# Altium project RFInterface.PrjPcb
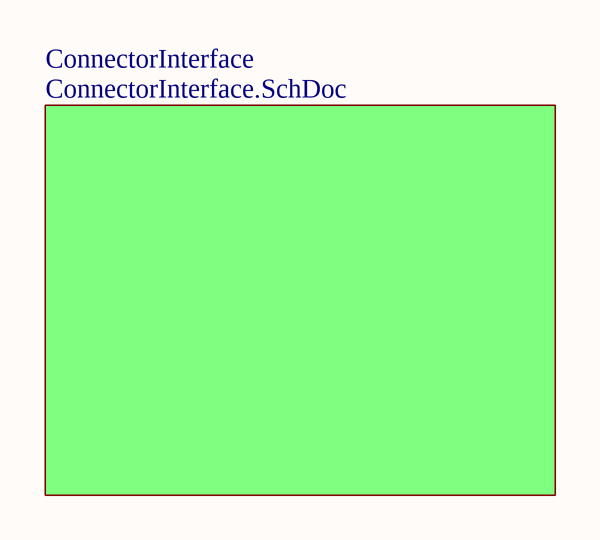
[diagram p0: TopLevel.SchDoc]
6 sheets, 103 parts. Net scope: flat (ports and power ports of the same name join across sheets).
Board file: RFI.PcbDoc
Sheets:
  TopLevel.SchDoc
    ConnectorInterface = ConnectorInterface.SchDoc
      RF_PDU = RF_PDU.SchDoc
      RF_Bypass = RF_Bypass.SchDoc
      RF_Gen = RF_Gen.SchDoc
      DAC = DAC.SchDoc

## Sheet TopLevel.SchDoc
size 215 x 279 mm; SheetNumber: 1; SheetTotal: 6

### Sub-sheets
ConnectorInterface = ConnectorInterface.SchDoc: no entries

### Notes on the sheet
- Contents
- Revision Notes

## Sheet ConnectorInterface.SchDoc
size 215 x 279 mm; SheetNumber: 2; SheetTotal: 6
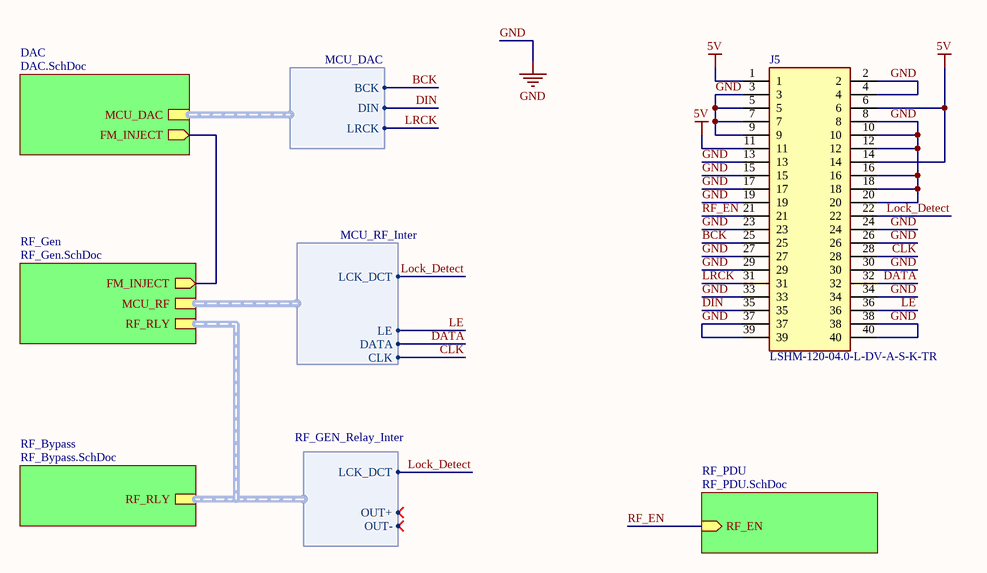
[diagram p1: ConnectorInterface.SchDoc]

### Parts
J5  LSHM-120-04.0-L-DV-A-S-K-TR  [LSHM-120-XX.X-YYY-DV-A-S-K-TR]

### Sub-sheets
DAC = DAC.SchDoc: FM_INJECT (out), MCU_DAC (harness MCU_DAC)
RF_Bypass = RF_Bypass.SchDoc: RF_RLY (harness RF_GEN_Relay_Inter)
RF_Gen = RF_Gen.SchDoc: MCU_RF (harness MCU_RF_Inter), FM_INJECT (out), RF_RLY (harness RF_GEN_Relay_Inter)
RF_PDU = RF_PDU.SchDoc: RF_EN (in)

### Harnesses
MCU_RF_Inter: LCK_DCT, LE, DATA, CLK
MCU_DAC: BCK, DIN, LRCK
RF_GEN_Relay_Inter: LCK_DCT, OUT+, OUT-

### Nets
5V: J5.1 J5.6 J5.11 J5.14
GND: J5.2 J5.3 J5.4 J5.5 J5.7 J5.8 J5.9 J5.10 J5.12 J5.13 J5.15 J5.16 J5.17 J5.18 J5.19 J5.20 J5.23 J5.24 J5.26 J5.27 J5.29 J5.30 J5.33 J5.34 J5.37 J5.38 J5.39 J5.40
BCK: J5.25 ; sheet DAC/MCU_DAC.BCK
CLK: J5.28 ; sheet RF_Gen/MCU_RF.CLK
DATA: J5.32 ; sheet RF_Gen/MCU_RF.DATA
DIN: J5.35 ; sheet DAC/MCU_DAC.DIN
LE: J5.36 ; sheet RF_Gen/MCU_RF.LE
Lock_Detect: J5.22 ; sheet RF_Gen/MCU_RF.LCK_DCT, sheet RF_Bypass/RF_RLY.LCK_DCT
LRCK: J5.31 ; sheet DAC/MCU_DAC.LRCK
RF_EN: J5.21 ; sheet RF_PDU/RF_EN
(unnamed): sheet RF_Gen/FM_INJECT, sheet DAC/FM_INJECT

### Buses and harness runs
harness sheet RF_Bypass/RF_RLY = sheet RF_Gen/RF_RLY

### Notes on the sheet
- Contents
- Revision Notes

### Library data of the parts
J5 = LSHM-120-04.0-L-DV-A-S-K-TR: Connector; Manufacturer_Name: SAMTEC; Datasheet Link: http://suddendocs.samtec.com/prints/lshm-1xx-xx.x-xxx-dv-a-x-x-xx-mkt.pdf; Manufacturer_Part_Number: LSHM-120-04.0-L-DV-A-S-K-TR; Mouser Part Number: 200-LSHM12004LDVASK; Mouser Price/Stock: https://www.mouser.co.uk/ProductDetail/Samtec/LSHM-120-040-L-DV-A-S-K-TR?qs=PB6%2FjmICvI1v5WBlLc04lg%3D%3D; Arrow Part Number: LSHM-120-04.0-L-DV-A-S-K-TR; Arrow Price/Stock: https://www.arrow.com/en/products/lshm-120-04.0-l-dv-a-sktr/samtec?region=nac

## Sheet RF_PDU.SchDoc
size 279 x 215 mm; SheetNumber: 6; SheetTotal: 6
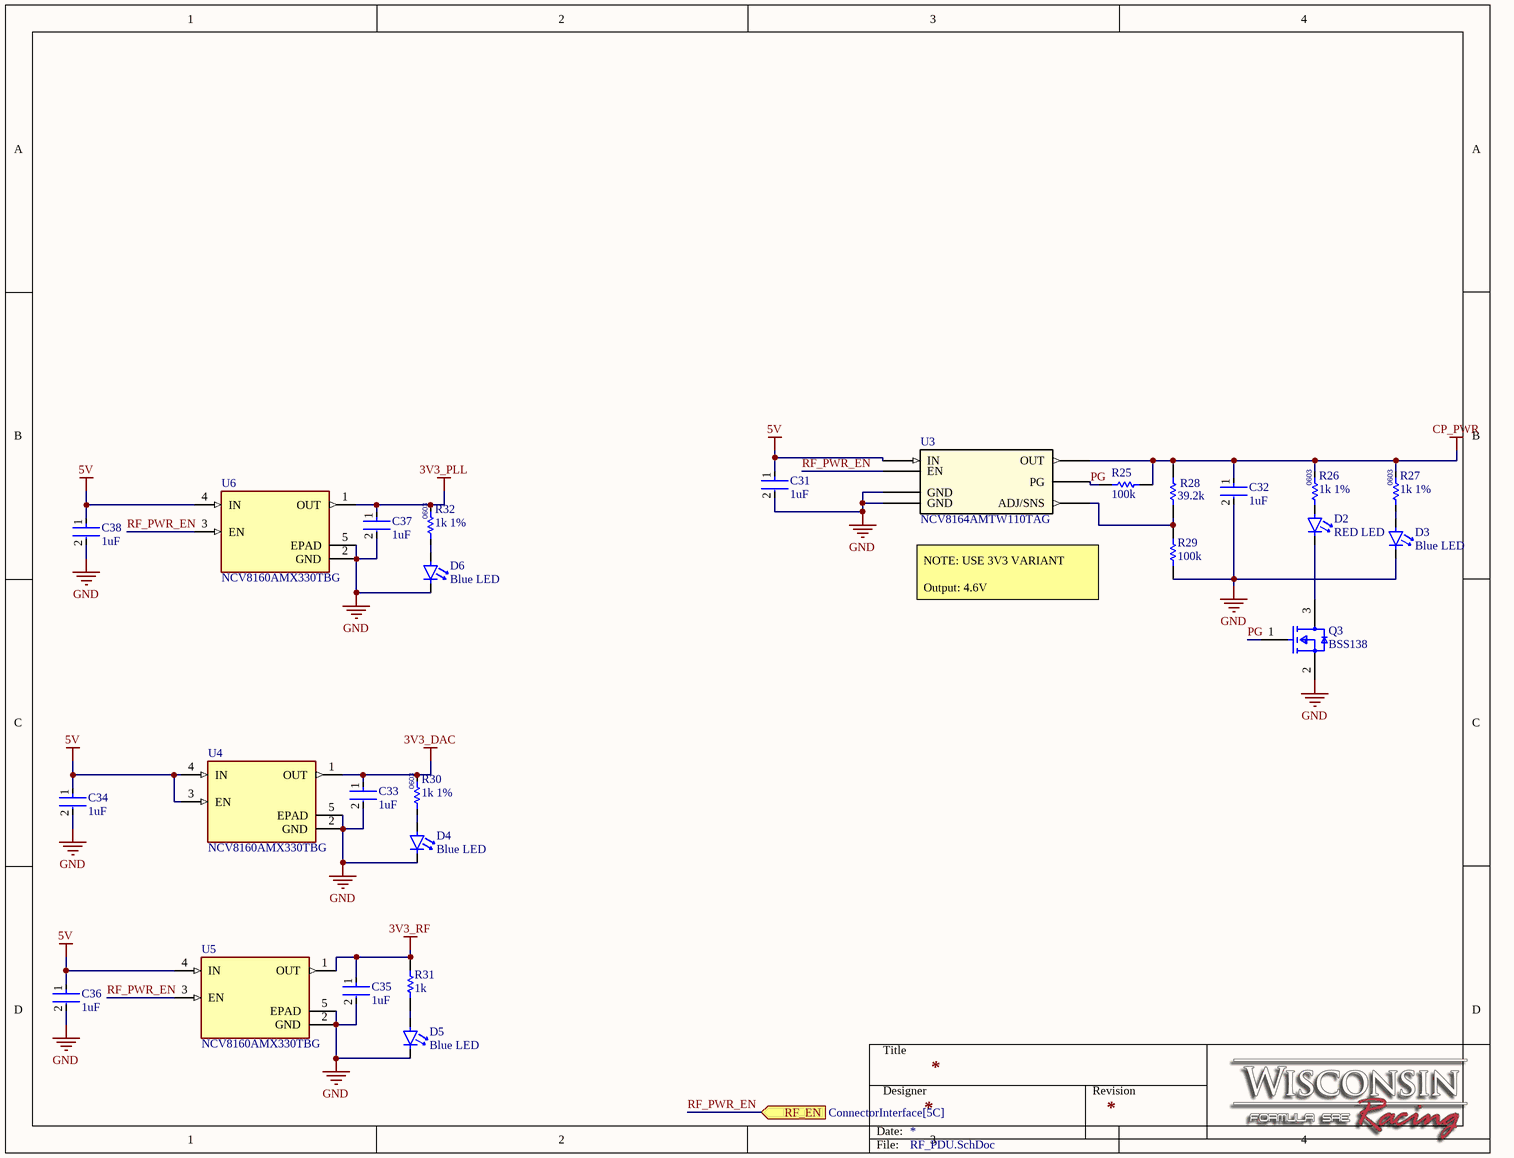
[diagram p2: RF_PDU.SchDoc]

### Parts
C31  1uF  [FP-GRM155-0_1-IPC_C]
C32  1uF  [FP-GRM155-0_1-IPC_C]
C33  1uF  [FP-GRM155-0_1-IPC_C]
C34  1uF  [FP-GRM155-0_1-IPC_C]
C35  1uF  [FP-GRM155-0_1-IPC_C]
C36  1uF  [FP-GRM155-0_1-IPC_C]
C37  1uF  [FP-GRM155-0_1-IPC_C]
C38  1uF  [FP-GRM155-0_1-IPC_C]
D2  RED LED  [DIOC1608X05N]
D3  Blue LED  [0603-LED-1]
D4  Blue LED  [0603-LED-1]
D5  Blue LED  [0603-LED-1]
D6  Blue LED  [0603-LED-1]
Q3  BSS138  [FP-318-08-IPC_B]
R25  100k  [RESC1005X40X25NL05T10]
R26  1k 1%  [Res0603-type-1]
R27  1k 1%  [Res0603-type-1]
R28  39.2k  [RESC1005X40X25ML05T10]
R29  100k  [RESC1005X40X25NL05T10]
R30  1k 1%  [Res0603-type-1]
R31  1k  [RESC1005X40X25LL05T10]
R32  1k 1%  [Res0603-type-1]
U3  NCV8164AMTW110TAG  [WDFNW6_511DW_OSI]
U4  NCV8160AMX330TBG  [VREG_NCV8160AMX330TBG]
U5  NCV8160AMX330TBG  [VREG_NCV8160AMX330TBG]
U6  NCV8160AMX330TBG  [VREG_NCV8160AMX330TBG]

### Ports
RF_EN (in, see ConnectorInterface[5C])

### Nets
3V3_DAC: C33.1 R30.2 U4.1(OUT)
3V3_PLL: C37.1 R32.2 U6.1(OUT)
3V3_RF: C35.1 R31.2 U5.1(OUT)
5V: C31.1 C34.1 C36.1 C38.1 U3.6(IN) U4.3(EN) U4.4(IN) U5.4(IN) U6.4(IN)
CP_PWR: C32.1 R25.1 R26.2 R27.2 R28.2 U3.1(OUT)
GND: C31.2 C32.2 C33.2 C34.2 C35.2 C36.2 C37.2 C38.2 D3.1(C) D4.1(C) D5.1(C) D6.1(C) Q3.2(S) R29.1 U3.5(GND) U3.7(GND) U4.2(GND) U4.5(EPAD) U5.2(GND) U5.5(EPAD) U6.2(GND) U6.5(EPAD)
PG: Q3.1(G) R25.2 U3.3(PG)
RF_PWR_EN: U3.4(EN) U5.3(EN) U6.3(EN) ; port RF_EN
NetD2_1: D2.1(C) Q3.3(D)
NetD3_2: D3.2(A) R27.1
NetD4_2: D4.2(A) R30.1
NetD5_2: D5.2(A) R31.1
NetD6_2: D6.2(A) R32.1
NetR28_1: R28.1 R29.2 U3.2(ADJ/SNS)

Not connected (* = marked no-connect by the designer): D2 2(A); R26 1

### Notes on the sheet
- NOTE: USE 3V3 VARIANT
  Output: 4.6V
- Title
- Designer
- Revision
- Date:
- File:
- (in symbol CMP-005-000017-1) 0603

### Library data of the parts
C31-C38 = CMP-06035-028020-1: Chip Multilayer Ceramic Capacitors for General Purpose, 0402, 1.0uF, X7R, 15%, 10%, 10V / GRM155Z71A105KE01D
D2 = CMP-221-0013-1: 0603 Red SMD Led; Datasheet: https://www.aopled.com/AOP_PDFs/L196L-LIC.pdf
D3-D6 = CMP-LED-0000-10: Single Color LED, Blue, Water Clear, 1.1mm; Lens Color: Colorless; Wavelength: 468nm; Luminous Intensity: 180mcd; Number of Elements: 1; Power Dissipation: 76mW; Max Power Dissipation: 75mW; Forward Current: 20mA; Forward Voltage: 3.8V; Lens Style: Diffused,Colorless,Clear,Rectangular; Dominant Wavelength: 475nm; Viewing Angle: 130°; Reverse Voltage: 5V; Length: 0.8mm; Max Operating Temperature: 80°C; Height: 0.55mm; Mount: Surface Mount; Number of Pins: 2; Lens Transparency: Clear; Color: Blue; Radiation Hardening: No; Illumination Color: Blue; Depth: 1.6mm; Packaging: Tape and Reel; Case Code (Imperial): 0603; Number of LEDs: 1; Lead Free: Lead Free; Case Code (Metric): 1608; Width: 0.8mm; Min Operating Temperature: -20°C; Case/Package: 0603; Package Quantity: 1; Test Current: 20mA
Q3 = CMP-07173-000101-1: MOSFET N-CH 50V 220MA SOT-23; Turn-Off Delay Time: 20ns; Element Configuration: Single; Rds On Max: 3.5R; Gate to Source Voltage (Vgs): 20V; Threshold Voltage: 1.3V; Number of Elements: 1; Power Dissipation: 360mW; Rise Time: 9ns; Turn-On Delay Time: 2.5ns; Input Capacitance: 27pF; On-State Resistance: 6R; Lead Free: Lead Free; Length: 2.92mm; Width: 1.3mm; Drain to Source Breakdown Voltage: 50V; Min Operating Temperature: -55°C; REACH SVHC: No SVHC; Packaging: Tape and Reel; Radiation Hardening: No; Height: 0.93mm; Drain to Source Voltage (Vdss): 50V; Current Rating: 220mA; Voltage Rating (DC): 50V; Weight: 0.03g; Continuous Drain Current (ID): 220mA; Number of Pins: 3; Nominal Vgs: 1.3V; Max Power Dissipation: 360mW; Fall Time: 9ns; Drain to Source Resistance: 3.5R; Contact Plating: Tin; Case/Package: SOT-23; Package Quantity: 1; Dual Supply Voltage: 50V; Mount: Surface Mount; Termination: SMD/SMT; Max Operating Temperature: 150°C
R25 R29 = CMP-2002-07343-1: Part Number: RC0402FR-07100KL; Manufacturer: Yageo / Phycomp
R26 R27 R30 R32 = CMP-005-000017-1: Fixed Resistor, Metal Glaze/thick Film, 0.1W, 1000ohm, 75V, 1% +/-Tol, 100ppm/Cel, Surface Mount, 0603; Min Operating Temperature: -55°C; Mount: Surface Mount; Packaging: Tape and Reel; Max Operating Temperature: 155°C
R28 = CMP-2002-07644-1: Part Number: RC0402FR-0739K2L; Manufacturer: Yageo
R31 = CMP-2002-07941-1: Part Number: RC0402JR-071KL; Manufacturer: Yageo / Phycomp
U3 = CMP-196-000000-3: LDO; Manufacturer_Name: onsemi; Source: NCV8164AMTW110TAG.SchLib; RefDes: RefDes; Design Item ID: NCV8164AMTW110TAG; Copyright: Copyright (C) 2025 Ultra Librarian. All rights reserved.; Manufacturer_Part_Number: NCV8164AMTW110TAG; Type: Power Management
U4-U6 = CMP-006-000097-1: Linear Voltage Regulator IC Positive Fixed 1 Output 250mA 4-XDFN (1x1); MF: ON Semiconductor; Design Item ID: NCV8160AMX330TBG; SnapEDA_Link: https://www.snapeda.com/parts/NCV8160AMX330TBG/Onsemi/view-part/?ref=snap; Pin Count: 5; Check_prices: https://www.snapeda.com/parts/NCV8160AMX330TBG/Onsemi/view-part/?ref=eda; Value: *; MP: NCV8160AMX330TBG; Source: NCV8160AMX330TBG.SchLib; Component Type: Standard; Package: XDFN-4 ON Semiconductor

## Sheet RF_Bypass.SchDoc
size 279 x 215 mm; SheetNumber: 5; SheetTotal: 6
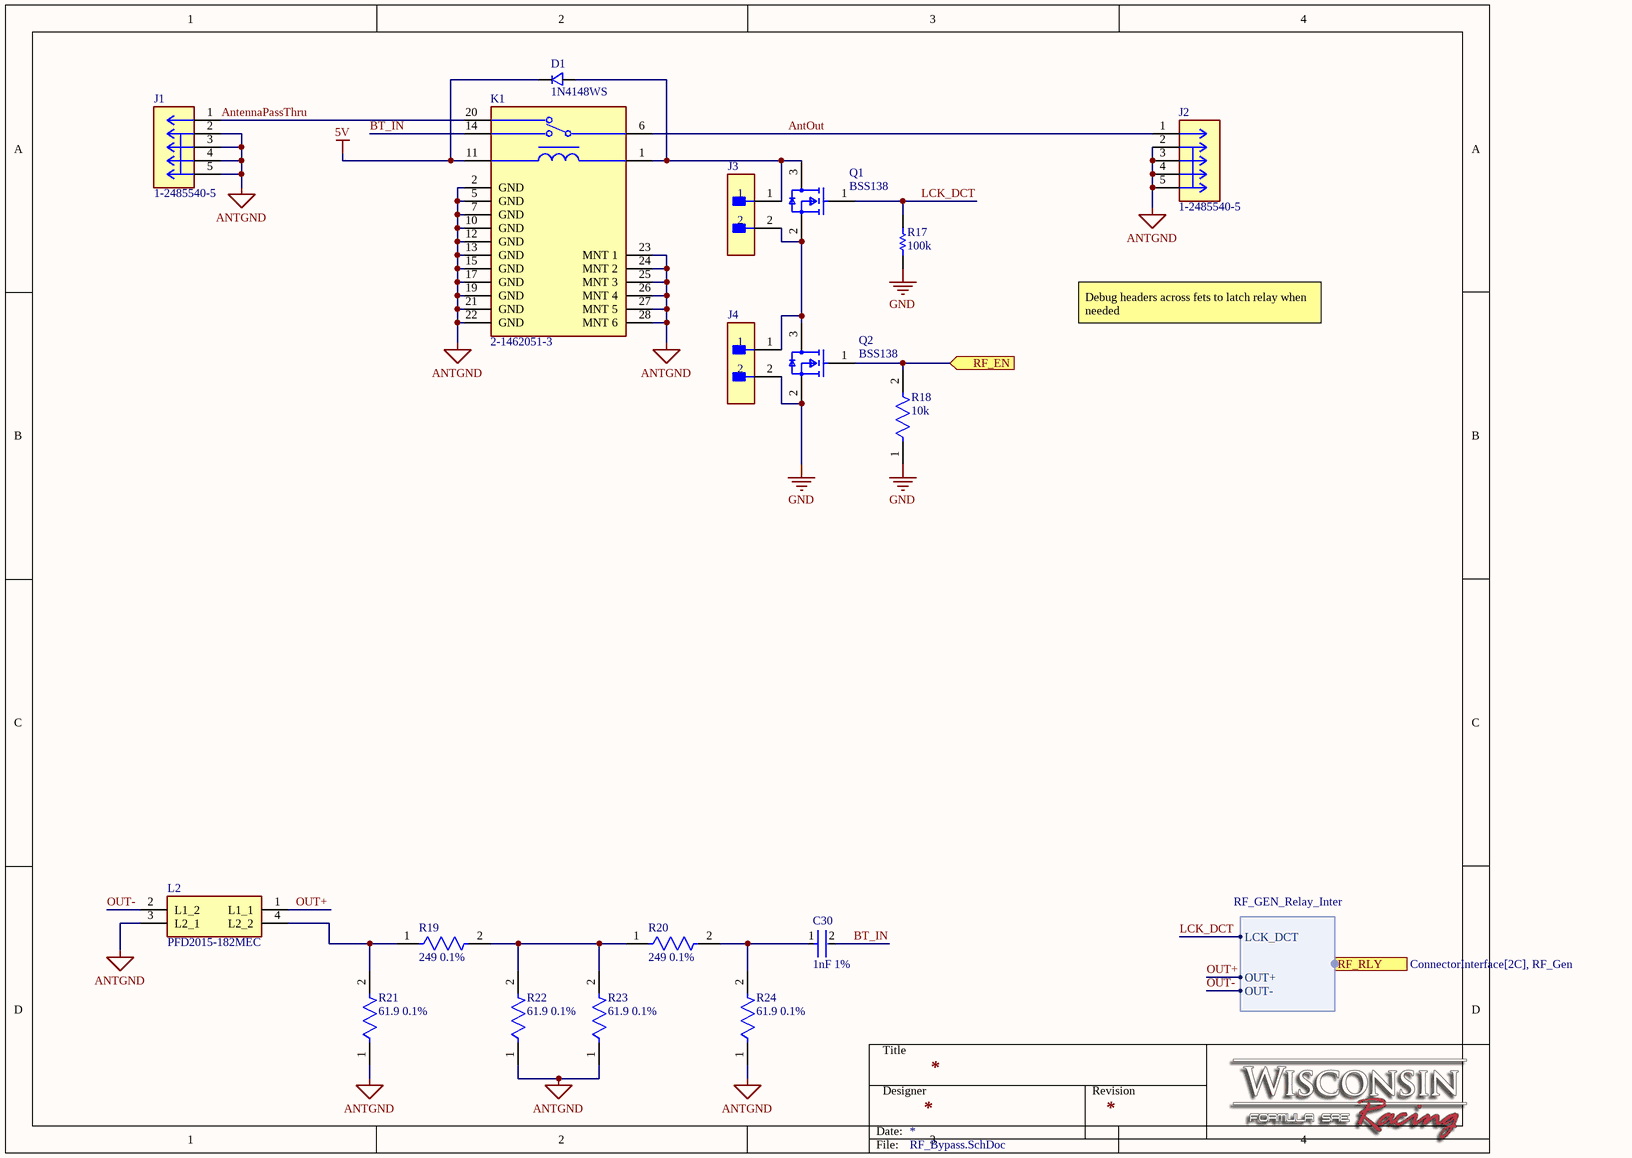
[diagram p3: RF_Bypass.SchDoc]

### Parts
C30  1nF 1%  [FP-GRT155-0_05-IPC_A]
D1  1N4148WS  [SODFL250X90-2N]
J1  1-2485540-5  [1-2485540-5-Footprint-1]
J2  1-2485540-5  [1-2485540-5-Footprint-1]
J3  TSM-102-01-T-SV-TR  [FP-TSM-102-01-T-SV-TR-MFG]  (value not drawn)
J4  TSM-102-01-T-SV-TR  [FP-TSM-102-01-T-SV-TR-MFG]  (value not drawn)
K1  2-1462051-3  [FP-2-1462051-3-MFG]
L2  PFD2015-182MEC  [PFD2015102MEB]
Q1  BSS138  [FP-318-08-IPC_B]
Q2  BSS138  [FP-318-08-IPC_B]
R17  100k  [RESC1005X40X25NL05T10]
R18  10k  [FP-RC0402-0_4-IPC_C]
R19  249 0.1%  [FP-RT0402-MFG]
R20  249 0.1%  [FP-RT0402-MFG]
R21  61.9 0.1%  [FP-RP73P-1E-MFG]
R22  61.9 0.1%  [FP-RP73P-1E-MFG]
R23  61.9 0.1%  [FP-RP73P-1E-MFG]
R24  61.9 0.1%  [FP-RP73P-1E-MFG]

### Ports
RF_EN (in), RF_RLY (harness RF_GEN_Relay_Inter, see ConnectorInterface[2C], RF_Gen)

### Harnesses
RF_GEN_Relay_Inter: LCK_DCT, OUT+, OUT-

### Nets
5V: D1.1 K1.11(-)
ANTGND: J1.2 J1.3 J1.4 J1.5 J2.2 J2.3 J2.4 J2.5 K1.2(GND) K1.5(GND) K1.7(GND) K1.10(GND) K1.12(GND) K1.13(GND) K1.15(GND) K1.17(GND) K1.19(GND) K1.21(GND) K1.22(GND) K1.23(MNT_1) K1.24(MNT_2) K1.25(MNT_3) K1.26(MNT_4) K1.27(MNT_5) K1.28(MNT_6) L2.3(L2_1) R21.1 R22.1 R23.1 R24.1
GND: J4.2 Q2.2(S) R17.1 R18.1
AntennaPassThru: J1.1 K1.20
AntOut: J2.1 K1.6
BT_IN: C30.2 K1.14
LCK_DCT: Q1.1(G) R17.2 ; port RF_RLY.LCK_DCT
OUT+: L2.1(L1_1) ; port RF_RLY.OUT+
OUT-: L2.2(L1_2) ; port RF_RLY.OUT-
RF_PWR_EN: Q2.1(G) R18.2 ; port RF_EN
NetC30_1: C30.1 R20.2 R24.2
NetD1_2: D1.2 J3.1 K1.1(+) Q1.3(D)
NetJ3_2: J3.2 J4.1 Q1.2(S) Q2.3(D)
NetL2_4: L2.4(L2_2) R19.1 R21.2
NetR19_2: R19.2 R20.1 R22.2 R23.2

### Notes on the sheet
- Debug headers across fets to latch relay when needed
- Title
- Designer
- Revision
- Date:
- File:

### Library data of the parts
C30 = CMP-06035-012909-1: Multi-Layer Ceramic Capacitor 1nF 50V C0G ±1% 0402 Paper T/R / GRT1555C1H102FA02D
D1 = CMP-REC-0001-6: Diode
J1 J2 = CMP-00172-1: FAKRA Connector, Plug, 50 ohm, Locking, 6 GHz, Cable-to-Board, 1 Position, Printed Circuit Board, -40 – 105 °C [-40 – 221 °F], Solder, FAKRA
J3 J4 = CMP-02766-000113-1: CONN HEADER SMD 2POS 2.54MM; Gender: Male; Max Voltage Rating (AC): 475V; Number of Contacts: 2; Max Current Rating: 7A; Contact Material: Bronze; Min Operating Temperature: -55°C; REACH SVHC: No SVHC; Housing Material: Polymer; Lead Free: Lead Free; Orientation: Straight; Radiation Hardening: No; Number of Rows: 1; Length: 5.08mm; Housing Color: Black; Max Operating Temperature: 105°C; Contact Plating: Tin; Depth: 2.54mm; Packaging: Tape and Reel; Pitch: 2.54mm; Termination: Solder
K1 = CMP-03396-000136-1: RELAY RF SPDT 2A 5V; Max Voltage Rating (AC): 250V; Contact Voltage Rating (DC): 220V; Operate Time: 3ms; Actuating System: DC; Release Time: 5ms; Coil Resistance: 178R; Coil Current: 28.1mA; Insertion Loss: -0.3dB; Coil Power: 140mW; Coil Type: Non-Latching; Contact Current Rating: 2A; Radiation Hardening: No; Voltage Rating (AC): 250V; ELV: Compliant; Max Voltage Rating (DC): 220V; Min Operating Temperature: -55°C; Coil Voltage (DC): 5V; Number of Pins: 22; Max Current Rating: 2A; Height: 10.5mm; Package Quantity: 250; Termination: PCB; Length: 14.9inch; RoHS Compliant: No; Packaging: Box; Width: 0.295inch; Depth: 9.4mm; Relay Type: Relay; Mount: Surface Mount; Throw Configuration: SPDT; Contact Plating: Gold; Contact Material: Nickel; Weight: 3oz; Series: HF3S, AXICOM; Max Operating Temperature: 85°C
L2 = PFD2015-102MEB: Inductor; Manufacturer_Name: COILCRAFT; Datasheet Link: https://www.coilcraft.com/pdfs/pfd2015_flyback.pdf; Height: 1.5mm; Manufacturer_Part_Number: PFD2015-102MEB; Mouser Part Number: 994-PFD2015-102MEB; Mouser Price/Stock: https://www.mouser.com/Search/Refine.aspx?Keyword=994-PFD2015-102MEB
Q1 Q2 = CMP-07173-000101-1: as Q3 on sheet RF_PDU; Lead Free: Lead Free; Length: 2.92mm; Width: 1.3mm; Drain to Source Breakdown Voltage: 50V; Min Operating Temperature: -55°C; REACH SVHC: No SVHC; Packaging: Tape and Reel; Radiation Hardening: No; Height: 0.93mm; Drain to Source Voltage (Vdss): 50V; Current Rating: 220mA; Voltage Rating (DC): 50V; Weight: 0.03g; Continuous Drain Current (ID): 220mA; Number of Pins: 3; Nominal Vgs: 1.3V; Max Power Dissipation: 360mW; Fall Time: 9ns; Drain to Source Resistance: 3.5R; Contact Plating: Tin; Case/Package: SOT-23; Package Quantity: 1; Dual Supply Voltage: 50V; Mount: Surface Mount; Termination: SMD/SMT; Max Operating Temperature: 150°C
R17 = CMP-2002-07343-1: as R25 on sheet RF_PDU
R18 = CMP-2002-07915-3: RES 10K OHM 5% 1/16W 0402; Max Power Dissipation: 63mW; Temperature Coefficient: 100ppm/°C; Power Rating: 62.5mW; Resistance: 10kR; Voltage Rating: 50V; Size Code: 0402; Resistance Tolerance: 5%; Packaging: Tape and Reel; Case Code (Metric): 1005; Lead Free: Lead Free; Resistor Type: Thick Film; Min Operating Temperature: -55°C; Military Standard: Not; Depth: 0.5mm; Series: RC; Case/Package: 0402; Construction: Rectangular; Number of Terminations: 2; Package Quantity: 1; Termination: SMD/SMT; Length: 0.039inch; Case Code (Imperial): 0402; Height: 0.016inch; Features: Moisture Resistant; RoHS Compliant: Yes; Max Operating Temperature: 155°C; Tolerance: 5%; Width: 0.02inch
R19 R20 = CMP-2002-02712-2: RES SMD 249 OHM 0.1% 1/16W 0402; Manufacturer: Yageo; Manufacturer Part Number: RT0402BRD07249RL; Temperature Coefficient: 25 ppm/°C; Power Rating: 0.063W; Value: 249Ω; Voltage Rating: 50V; Tolerance: 0.001; Footprint Url: http://www.yageo.com/exep/pages/download/literatures/PYu-R_Mount_10.pdf; Device Class L3: Chip SMD Resistors; Category: Res; Resistance: 249Ω; Device Class L2: Resistors; Height: 0.35mm; Device Class L1: Passive Components; Package: RT0402; Ipc Land Pattern Name: RESC10050X30; Temperature Range Low: -55°C; Lead Free: Yes; ComponentLink2Description: Datasheet; Octopart: https://octopart.com/rt0402brd07249rl-yageo-1467928; Digikey Description: RES SMD 249 OHM 0.1% 1/16W 0402; Automotive: No; Composition: Thin Film; Temperature: -55°C to +155°C; RoHS: TRUE; Temperature Range High: +155°C; Series: RT; Mouser Description: Thin Film Resistors - SMD 1/16W 249 ohm .1% 25ppm; ComponentLink2URL: http://www.yageo.com/documents/recent/PYu-RT_1-to-0.01_RoHS_L_9.pdf
R21-R24 = CMP-03211-009150-1: RP73P 0402 61.9Ω 0.1W 25ppm/°C 0.10% 50V; Manufacturer: TE Connectivity; Manufacturer Part Number: RP73PF1E61R9BTD; Temperature Coefficient: 25ppm/°C; Temperature: -55°C to +155°C; Voltage Rating: 50V; Composition: Thin Film; Value: 61.9Ω; Ipc Land Pattern Name: RESC10050X30; Device Class L3: Chip SMD Resistors; Resistance: 61.9Ω; Octopart: https://octopart.com/rp73pf1e61r9btd-te+connectivity-89230235; ComponentLink2URL: https://www.te.com/commerce/DocumentDelivery/DDEController?Action=srchrtrv&DocNm=1773272&DocType=DS&DocLang=English; RoHS: TRUE; Device Class L2: Resistors; Series: RP73P; Temperature Range Low: -55°C; Category: Res; ComponentLink2Description: Datasheet; Temperature Range High: +155°C; Height: 0.35mm; Lead Free: Yes; Automotive: No; Power Rating: 0.1W; Package: RP73P-1E; Device Class L1: Passive Components; Tolerance: 0.10%

## Sheet RF_Gen.SchDoc: RF Generation & Regulation
size 279 x 215 mm; Engineer: Shaashwat Sahoo; Revision: V1.0; SheetNumber: 3; SheetTotal: 6; SPICEModelCacheMXYIGOMC: <root> / <DocumentId>MXYIGOMC</DocumentId> / <CacheFrame Number="0"> / <Model Name="cap" Kind="MDL"> / <Text>*Default semiconductor capacitor / .MODEL CAP C()</Text> / </Model> / </CacheFrame> / </root>
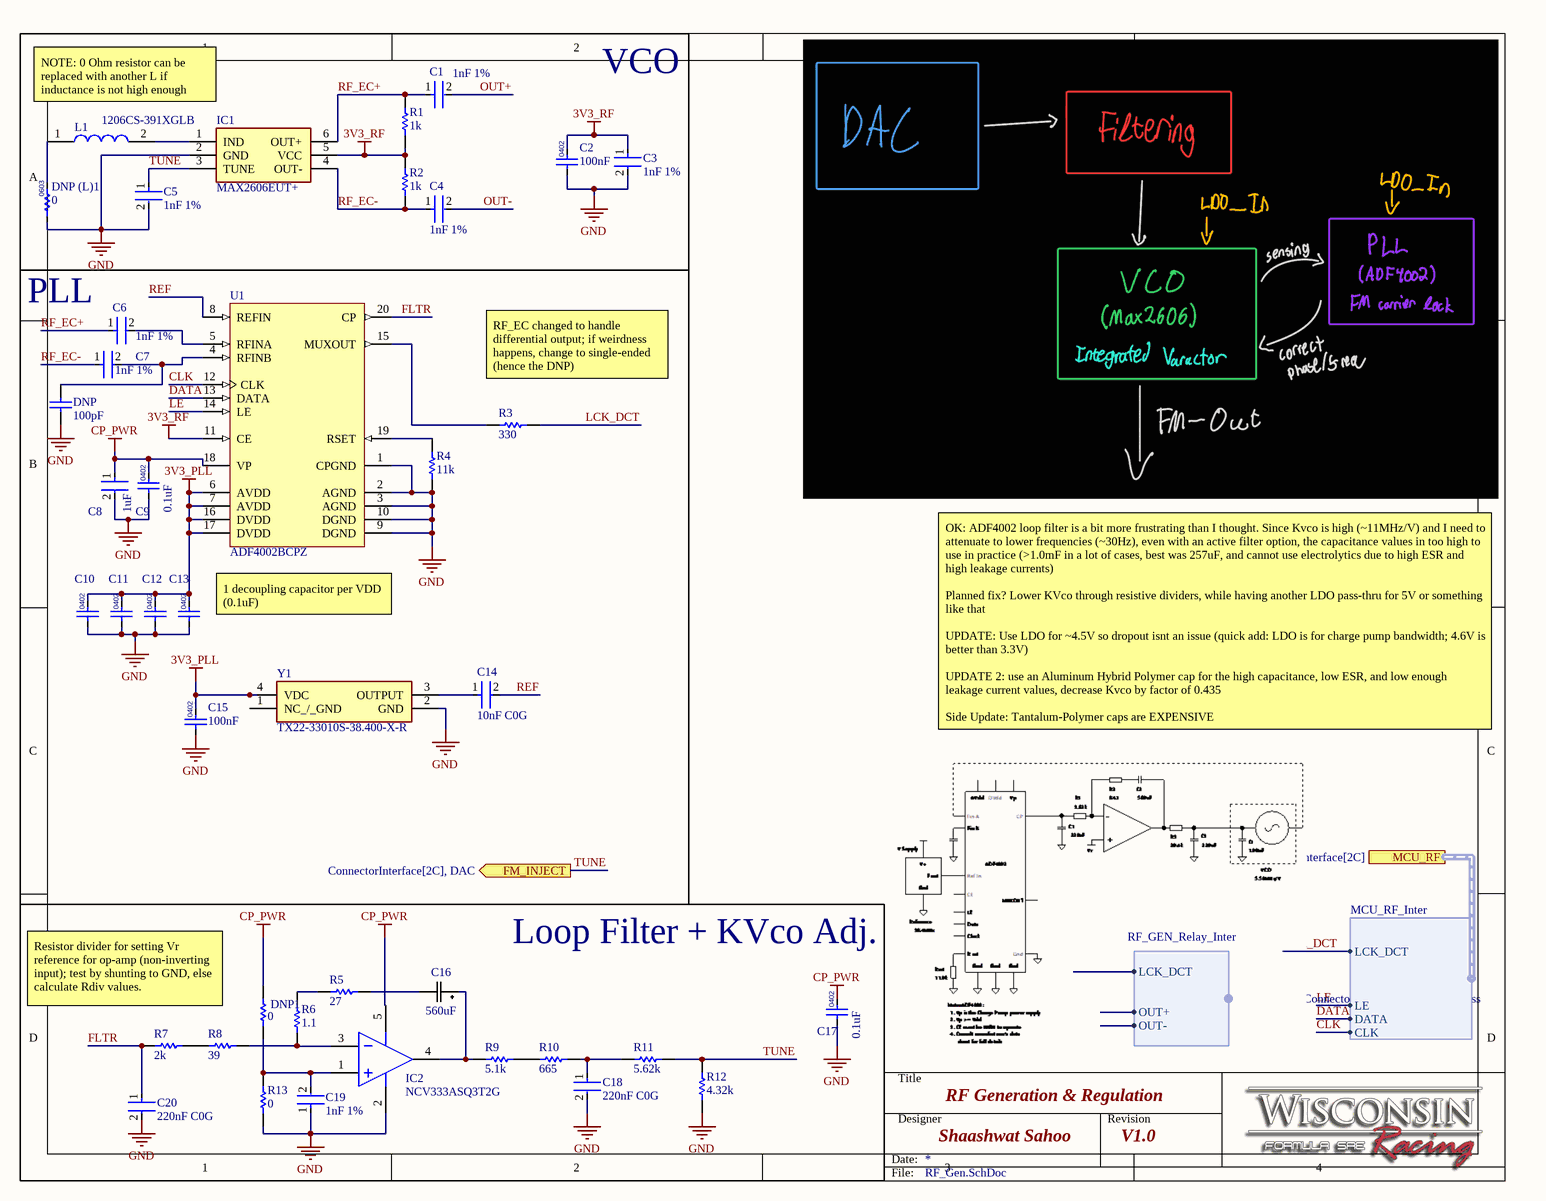
[diagram p4: RF_Gen.SchDoc]

### Parts
C1  1nF 1%  [FP-GRT155-0_05-IPC_A]
C2  100nF  [FP-CC0402-IPC_B]
C3  1nF 1%  [FP-GRT155-0_05-IPC_A]
C4  1nF 1%  [FP-GRT155-0_05-IPC_A]
C5  1nF 1%  [FP-GRT155-0_05-IPC_A]
C6  1nF 1%  [FP-GRT155-0_05-IPC_A]
C7  1nF 1%  [FP-GRT155-0_05-IPC_A]
C8  1uF  [FP-GRM155-0_1-IPC_A]
C9  0.1uF  [FP-CC0402-IPC_B]
C10  0.1uF  [FP-CC0402-IPC_B]  (value not drawn)
C11  0.1uF  [FP-CC0402-IPC_B]  (value not drawn)
C12  0.1uF  [FP-CC0402-IPC_B]  (value not drawn)
C13  0.1uF  [FP-CC0402-IPC_B]  (value not drawn)
C14  10nF C0G  [FP-GRM155-0_15-MFG]
C15  100nF  [FP-CC0402-IPC_B]
C16  560uF  [CAP_GY_10X10_NCH]
C17  0.1uF  [FP-CC0402-IPC_B]
C18  220nF C0G  [FP-GRM31C-0_2-e0_3_0_8-IPC_B]
C19  1nF 1%  [FP-GRT155-0_05-IPC_A]
C20  220nF C0G  [FP-GRM31C-0_2-e0_3_0_8-IPC_B]
DNP  100pF  [CAPC1005X55X25ML05T10]
DNP1  0  [RESC1005X40X25NL05T10]
DNP_(L)1  0  [Res0603-type-2]
IC1  MAX2606EUT+  [SOT95P280X145-6N]
IC2  NCV333ASQ3T2G  [SOT65P210X110-5N]
L1  1206CS-391XGLB  [INDC3622X152N]
R1  1k  [RESC1005X40X25LL05T10]
R2  1k  [RESC1005X40X25LL05T10]
R3  330  [RESC1005X40X25LL05T10]
R4  11k  [RESC1005X40X25NL05T10]
R5  27  [RESC1005X40X25LL05T10]
R6  1.1  [RESC1005X40X25NL05T10]
R7  2k  [RESC1005X35X25NL10T10]
R8  39  [RESC1005X40X25LL05T10]
R9  5.1k  [RESC1005X40X25NL05T10]
R10  665  [RESC1005X40X25ML05T10]
R11  5.62k  [RESC1005X40X25LL05T10]
R12  4.32k  [RESC1005X40X25NL05T10]
R13  0  [RESC1005X40X25NL05T10]
U1  ADF4002BCPZ  [ADI-CP-20-1_L]
Y1  TX22-33010S-38.400-X-R  [TX2233010S38400XR]

### Blocks framed on the sheet
VCO: C1-C5 DNP_(L)1 IC1 L1 R1 R2
PLL: C6-C15 DNP R3 R4 U1 Y1
Loop Filter + KVco Adj.: C16-C20 DNP1 IC2 R5-R13

### Ports
FM_INJECT (out, see ConnectorInterface[2C], DAC), MCU_RF (harness MCU_RF_Inter, see ConnectorInterface[2C]), RF_RLY (harness RF_GEN_Relay_Inter, see ConnectorInterface[2C], RF_Bypass)

### Harnesses
MCU_RF_Inter: LCK_DCT, LE, DATA, CLK
RF_GEN_Relay_Inter: LCK_DCT, OUT+, OUT-

### Nets
3V3_PLL: C10.2 C11.2 C12.2 C13.2 C15.2 U1.6(AVDD) U1.7(AVDD) U1.16(DVDD) U1.17(DVDD) Y1.4(VDC)
3V3_RF: C2.2 C3.1 IC1.5(VCC) R1.1 R2.2 U1.11(CE)
CP_PWR: C8.1 C9.2 C17.2 DNP1.2 IC2.5(V-) U1.18(VP)
GND: C2.1 C3.2 C5.2 C8.2 C9.1 C10.1 C11.1 C12.1 C13.1 C15.1 C17.1 C18.2 C19.1 C20.2 DNP.2 DNP_(L)1.1 IC1.2(GND) IC2.2(V-) R4.1 R12.1 R13.1 U1.1(CPGND) U1.2(AGND) U1.3(AGND) U1.9(DGND) U1.10(DGND) Y1.2(GND)
CLK: U1.12(CLK) ; port MCU_RF.CLK
DATA: U1.13(DATA) ; port MCU_RF.DATA
FLTR: C20.1 R7.1 U1.20(CP)
LCK_DCT: R3.2 ; port MCU_RF.LCK_DCT, port RF_RLY.LCK_DCT
LE: U1.14(LE) ; port MCU_RF.LE
OUT+: C1.2 ; port RF_RLY.OUT+
OUT-: C4.2 ; port RF_RLY.OUT-
REF: C14.2 U1.8(REFIN)
RF_EC+: C1.1 C6.1 IC1.6(OUT+) R1.2
RF_EC-: C4.1 C7.1 IC1.4(OUT-) R2.1
TUNE: C5.1 IC1.3(TUNE) R11.2 R12.2 ; port FM_INJECT
NetC6_2: C6.2 U1.5(RFINA)
NetC7_2: C7.2 DNP.1 U1.4(RFINB)
NetC14_1: C14.1 Y1.3(OUTPUT)
NetC16_1: C16.1 IC2.4(OUT) R9.1
NetC16_2: C16.2 R5.2
NetC18_1: C18.1 R10.2 R11.1
NetC19_2: C19.2 DNP1.1 IC2.1(IN+) R13.2
NetDNP_(L)1_2: DNP_(L)1.2 L1.1
NetIC1_1: IC1.1(IND) L1.2
NetIC2_3: IC2.3(IN-) R6.1 R8.2
NetR3_1: R3.1 U1.15(MUXOUT)
NetR4_2: R4.2 U1.19(RSET)
NetR5_1: R5.1 R6.2
NetR7_2: R7.2 R8.1
NetR9_2: R9.2 R10.1

Not connected (* = marked no-connect by the designer): Y1 1(NC_/_GND)

### Notes on the sheet
- NOTE: 0 Ohm resistor can be replaced with another L if inductance is not high enough
- (near R3) RF_EC changed to handle differential output; if weirdness happens, change to single-ended (hence the DNP)
- 1 decoupling capacitor per VDD (0.1uF)
- OK: ADF4002 loop filter is a bit more frustrating than I thought. Since Kvco is high (~11MHz/V) and I need to attenuate to lower frequencies (~30Hz), even with an active filter option, the capacitance values in too high to use in practice (>1.0mF in a lot of cases, best was 257uF, and cannot use electrolytics due to high ESR and high leakage currents)
  Planned fix? Lower KVco through resistive dividers, while having another LDO pass-thru for 5V or something like that
  UPDATE: Use LDO for ~4.5V so dropout isnt an issue (quick add: LDO is for charge pump bandwidth; 4.6V is better than 3.3V)
  UPDATE 2: use an Aluminum Hybrid Polymer cap for the high capacitance, low ESR, and low enough leakage current values, decrease Kvco by factor of 0.435
  Side Update: Tantalum-Polymer caps are EXPENSIVE
- Resistor divider for setting Vr reference for op-amp (non-inverting input); test by shunting to GND, else calculate Rdiv values.
- Title
- Designer
- Revision
- Date:
- File:
- (in symbol CMP-Cap-00006-1) 0402
- (in symbol CMP-Res-00022-2) 0603

### Library data of the parts
C1 C3-C7 C19 = CMP-06035-012909-1: as C30 on sheet RF_Bypass
C2 C15 = CMP-Cap-00006-1: Ceramic Capacitor, Multilayer, Ceramic, 16V, 10% +Tol, 10% -Tol, X7R, 15% TC, 0.1uF, Surface Mount, 0402; Dielectric: XR7; Tolerance: 10%; Capacitance: 100nF; Voltage Rating: 16V
C8 = CMP-06035-012596-1: Chip Multilayer Ceramic Capacitors for General Purpose, 0402, 1.0uF, X7R, 15%, 10%, 10V
C9-C13 C17 = CMP-Cap-00006-1: Ceramic Capacitor, Multilayer, Ceramic, 16V, 10% +Tol, 10% -Tol, X7R, 15% TC, 0.1uF, Surface Mount, 0402; Dielectric: XR7; Capacitance: 100nF; Tolerance: 10%; Voltage Rating: 16V
C14 = CMP-06035-053372-1: Chip Multilayer Ceramic Capacitors for General Purpose, 0402, 10000pF, C0G, 30ppm/°C, 5%, 35V
C16 = CMP-034-000012-1: Description; Manufacturer_Name: Nichicon; Copyright: Copyright (C) 2025 Ultra Librarian. All rights reserved.; Design Item ID: GYB1J560MCQ1GS; Manufacturer_Part_Number: GYB1J560MCQ1GS; Source: GYB1J560MCQ1GS.SchLib
C18 C20 = CMP-06035-005862-1: Chip Multilayer Ceramic Capacitors for General Purpose, 1206, 0.22uF, C0G, 30ppm/°C, 5%, 25V
DNP = CMP-2008-03915-1: Manufacturer: Murata; Part Number: GRM1555C1H101JA01D
DNP1 R13 = CMP-1011-00001-2: Manufacturer: Yageo / Phycomp; Part Number: RC0402JR-070RL
DNP_(L)1 = CMP-Res-00022-2: Fixed Resistor, Metal Glaze/thick Film, 0.1W, 0ohm, Surface Mount, 0603; Tolerance: 0.1%; Power: 100mW; Resistance: 0
IC1 = MAX2606EUT+: Integrated Circuit; Manufacturer_Name: Analog Devices; Datasheet Link: https://datasheets.maximintegrated.com/en/ds/MAX2605-MAX2609.pdf; Height: 1.45mm; Manufacturer_Part_Number: MAX2606EUT+; Mouser Part Number: 700-MAX2606EUT+; Mouser Price/Stock: https://www.mouser.co.uk/ProductDetail/Analog-Devices-Maxim-Integrated/MAX2606EUT%2b?qs=U8%2FOE6X5Fv%2F2oJ3nHVn6vA%3D%3D
IC2 = CMP-006-000098-2: Low Offset Voltage: 10 V max (NCS333); Manufacturer_Name: onsemi; Design Item ID: NCV333ASQ3T2G; Manufacturer_Part_Number: NCV333ASQ3T2G; Source: SamacSys.SchLib; Datasheet Link: https://www.onsemi.com/pub/Collateral/NCS333-D.PDF; Height: 1.1mm; Arrow Part Number: NCV333ASQ3T2G; Arrow Price/Stock: https://www.arrow.com/en/products/ncv333asq3t2g/on-semiconductor?region=nac; Mouser Part Number: 863-NCV333ASQ3T2G; Mouser Price/Stock: https://www.mouser.co.uk/ProductDetail/onsemi/NCV333ASQ3T2G?qs=f9yNj16SXrKU9Ty3EUv2qA%3D%3D
L1 = 1206CS-391XGLB: Inductor; Manufacturer_Name: COILCRAFT; Datasheet Link: https://componentsearchengine.com/Datasheets/2/1206CS-391XGLB.pdf; Height: 1.52mm; Manufacturer_Part_Number: 1206CS-391XGLB
R1 R2 = CMP-2002-07941-1: as R31 on sheet RF_PDU
R3 = CMP-2002-07613-1: Part Number: RC0402FR-07330RL; Manufacturer: Yageo / Phycomp
R4 R9 = CMP-2002-07753-1: Part Number: RC0402FR-075K1L; Manufacturer: Yageo / Phycomp
R5 = CMP-2002-07055-1: Part Number: RC0402FR-0727RL; Manufacturer: Yageo / Phycomp
R6 = CMP-1011-00175-2: Part Number: RC0402FR-071R1L; Manufacturer: Yageo / Phycomp
R7 = CMP-2002-02941-1: Manufacturer: Yageo; Part Number: RT0402BRD072KL
R8 = CMP-1011-00350-2: Manufacturer: Yageo / Phycomp; Part Number: RC0402FR-0739RL
R10 = CMP-2002-07113-1: Part Number: RC0402FR-07665RL; Manufacturer: Yageo / Phycomp
R11 = CMP-2002-07755-1: Part Number: RC0402FR-075K62L; Manufacturer: Yageo / Phycomp
R12 = CMP-1011-00582-2: Part Number: RC0402FR-074K32L; Manufacturer: Yageo / Phycomp
U1 = CMP-006-000099-1: Clock Generator/Frequency Synthesizer /PLL; Manufacturer Lifecycle Status: PRODUCTION; Nominal Supply Current: 5mA; Input: CMOS; Number of Elements: 1; Frequency: 400MHz; Max Supply Voltage: 3.3V; Operating Supply Voltage: 3V; Max Supply Current: 6mA; Min Supply Voltage: 2.7V; Lifecycle Status: Production; Radiation Hardening: No; RoHS: Compliant; Width: 4mm; Height: 830µm; Bandwidth: 400MHz; REACH SVHC: No; Termination: SMD/SMT; Number of Outputs: 1; Mounting Technology: Surface Mount; Operating Supply Current: 5mA; Min Operating Temperature: -40°C; Clock Frequency: 400MHz; Case/Package: LFCSP EP; Max Operating Temperature: 85°C; Packaging: Bulk; Contact Plating: Tin; Pins: 20; Number of Circuits: 1; Schedule B: 8542390000, 8542390000; Length: 4mm
Y1 = TX22-33010S-38.400-X-R: Crystal or Oscillator; Manufacturer_Name: Aker Technology; Datasheet Link: https://aker-usa.com/spec/TX22.pdf; Height: 0.95mm; Manufacturer_Part_Number: TX22-33010S-38.400-X-R

## Sheet DAC.SchDoc
size 279 x 215 mm; SheetNumber: 4; SheetTotal: 6; SPICEModelCacheRUGZJIPY: <root> / <DocumentId>RUGZJIPY</DocumentId> / <CacheFrame Number="0"> / <Model Name="cap" Kind="MDL"> / <Text>*Default semiconductor capacitor / .MODEL CAP C()</Text> / </Model> / </CacheFrame> / </root>
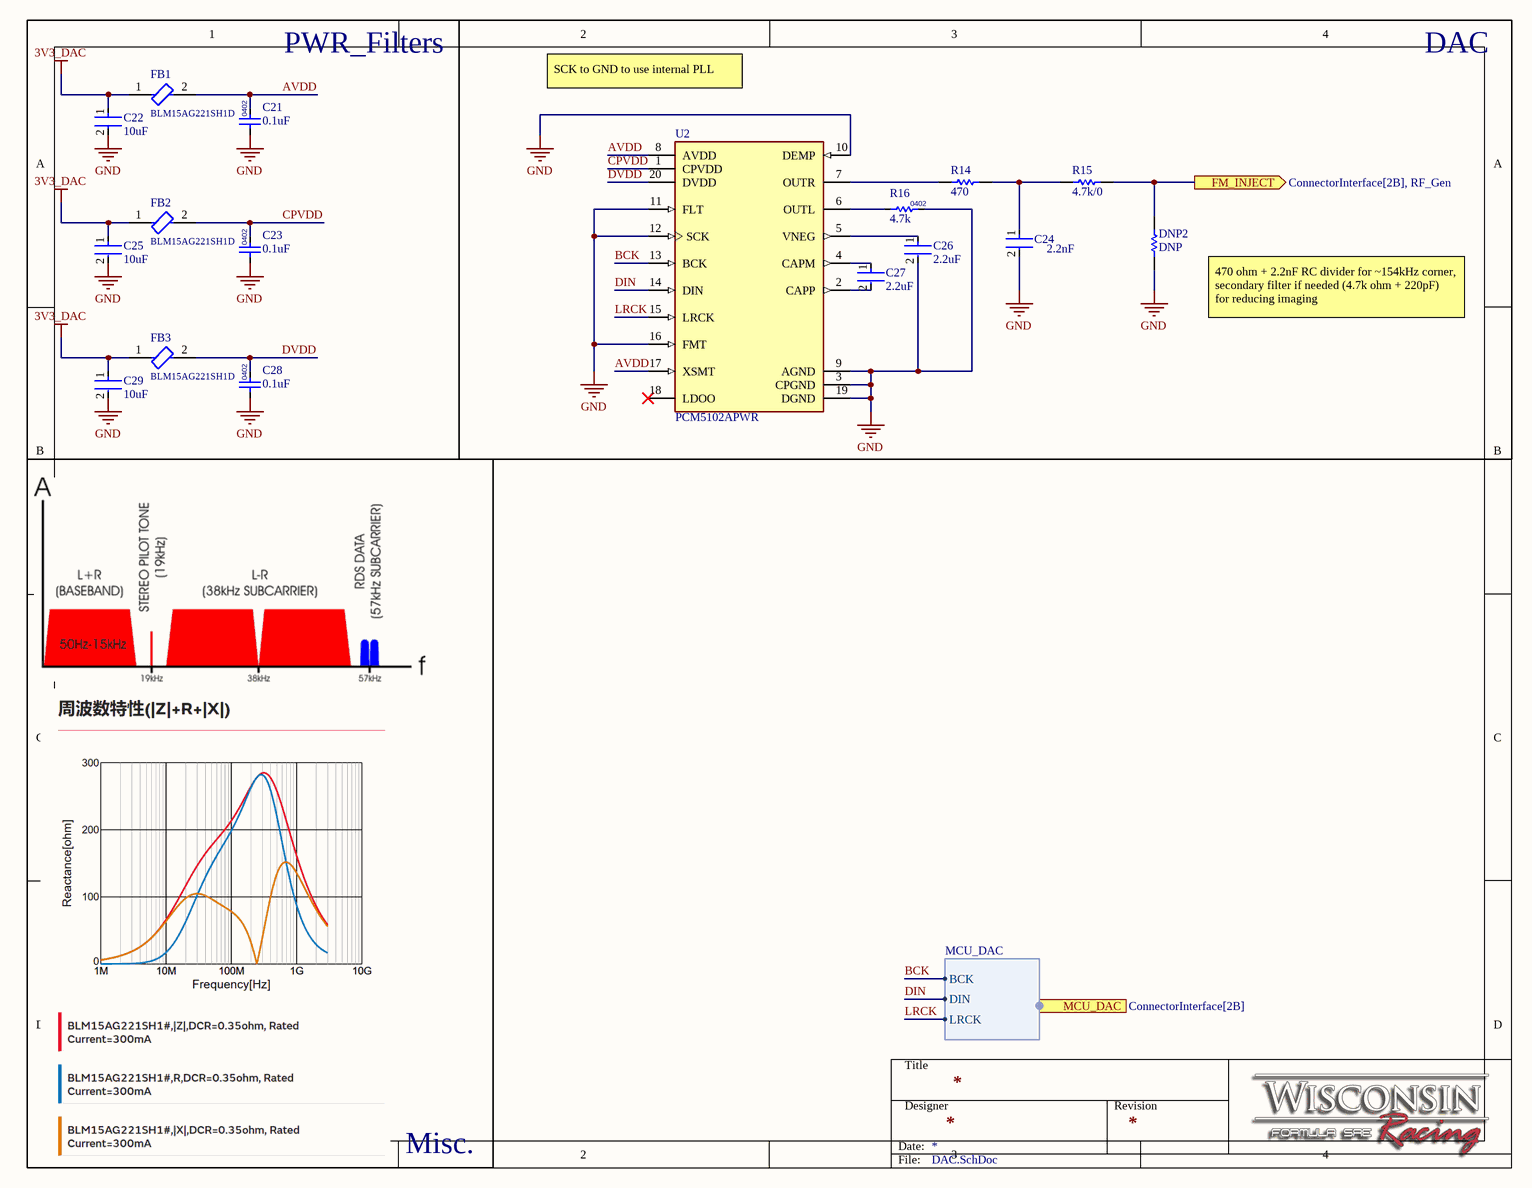
[diagram p5: DAC.SchDoc]

### Parts
C21  0.1uF  [FP-CC0402-IPC_B]
C22  10uF  [FP-C0402C106M9PACTU-MFG]
C23  0.1uF  [FP-CC0402-IPC_B]
C24  2.2nF  [FP-GRM155-0_05-IPC_C]
C25  10uF  [FP-C0402C106M9PACTU-MFG]
C26  2.2uF  [FP-GRM155-0_2-IPC_B]
C27  2.2uF  [FP-GRM155-0_2-IPC_B]
C28  0.1uF  [FP-CC0402-IPC_B]
C29  10uF  [FP-C0402C106M9PACTU-MFG]
DNP2  DNP  [RESC1005X40X25NL05T10]
FB1  BLM15AG221SH1D  [FP-BLM15-0_05-MFG]
FB2  BLM15AG221SH1D  [FP-BLM15-0_05-MFG]
FB3  BLM15AG221SH1D  [FP-BLM15-0_05-MFG]
R14  470  [RESC1005X40X25ML05T10]
R15  4.7k/0  [RESC1005X40X25NL05T10]
R16  value 4.7k  [RESC1005X40X25NL05T10]  (hidden comment: 4.7k 1%)
U2  PCM5102APWR  [FP-PW0020A-IPC_A]

### Blocks framed on the sheet
PWR_Filters: C21-C23 C25 C28 C29 FB1-FB3
DAC: C24 C26 C27 DNP2 R14-R16 U2

### Ports
FM_INJECT (out, see ConnectorInterface[2B], RF_Gen), MCU_DAC (harness MCU_DAC, see ConnectorInterface[2B])

### Harnesses
MCU_DAC: BCK, DIN, LRCK

### Nets
3V3_DAC: C22.1 C25.1 C29.1 FB1.1 FB2.1 FB3.1
GND: C21.1 C22.2 C23.1 C24.2 C25.2 C26.2 C28.1 C29.2 DNP2.1 R16.2 U2.3(CPGND) U2.9(AGND) U2.10(DEMP) U2.11(FLT) U2.12(SCK) U2.16(FMT) U2.19(DGND)
AVDD: C21.2 FB1.2 U2.8(AVDD) U2.17(XSMT)
BCK: U2.13(BCK) ; port MCU_DAC.BCK
CPVDD: C23.2 FB2.2 U2.1(CPVDD)
DIN: U2.14(DIN) ; port MCU_DAC.DIN
DVDD: C28.2 FB3.2 U2.20(DVDD)
LRCK: U2.15(LRCK) ; port MCU_DAC.LRCK
TUNE: DNP2.2 R15.2 ; port FM_INJECT
NetC24_1: C24.1 R14.2 R15.1
NetC26_1: C26.1 U2.5(VNEG)
NetC27_1: C27.1 U2.4(CAPM)
NetC27_2: C27.2 U2.2(CAPP)
NetR14_1: R14.1 U2.7(OUTR)
NetR16_1: R16.1 U2.6(OUTL)

Not connected (* = marked no-connect by the designer): U2 18(LDOO)*

### Notes on the sheet
- SCK to GND to use internal PLL
- 470 ohm + 2.2nF RC divider for ~154kHz corner, secondary filter if needed (4.7k ohm + 220pF)  for reducing imaging
- Misc.
- Title
- Designer
- Revision
- Date:
- File:
- (in symbol CMP-Cap-00006-1) 0402

### Library data of the parts
C21 C23 C28 = CMP-Cap-00006-1: as C9 on sheet RF_Gen; Tolerance: 10%; Voltage Rating: 16V
C22 C25 C29 = CMP-03020-034678-1: CAP CER 10UF 6.3V X5R 0402; Tolerance: 20%; Dielectric Material: Ceramic; Voltage Rating: 6.3V; Thickness: 0.028inch; REACH SVHC: No SVHC; RoHS Compliant: Yes; Case Code (Metric): 1005; Lead Free: Lead Free; Length: 0.039inch; Max Operating Temperature: 85°C; Capacitance: 10uF; Voltage Rating (DC): 6.3V; Min Operating Temperature: -55°C; Case/Package: 0402; Mount: Surface Mount; Case Code (Imperial): 0402; Dielectric: X5R; Packaging: Cut Tape; Width: 0.02inch
C24 = CMP-06035-062041-1: Chip Multilayer Ceramic Capacitors for General Purpose, 0402, 2200pF, C0G, 30ppm/°C, 5%, 50V
C26 C27 = CMP-06035-003072-1: Chip Multilayer Ceramic Capacitors for General Purpose, 0402, 2.2uF, X7R, 15%, 10%, 10V; Case/Package: 0402
DNP2 R15 = CMP-1011-00001-2: as DNP1 on sheet RF_Gen
FB1-FB3 = CMP-06046-002173-1: Chip Ferrite Bead, 0402, 220Ω @ 100MHz, 0.35Ω, 25%, 300mA; Impedance: 220R; Number of Lines: 1; DC Resistance (DCR): 350mR; Package Quantity: 10000; Max Operating Temperature: 125°C; Case Code (Imperial): 0402; Ratings: AEC-Q200; Packaging: Tape and Reel; Width: 0.5mm; Core Material: Ferrite; Length: 0.039inch; Max Current Rating: 300mA; REACH SVHC: No SVHC; Weight: 2.3E-05oz; Height: 0.022inch; Max DC Current: 300mA; Series: EMIFIL®, BLM15A_SH; Test Frequency: 100MHz; Min Operating Temperature: -55°C; Termination: SMD/SMT; Mount: Surface Mount; Case Code (Metric): 1005; Depth: 0.55mm; Case/Package: 0402; RoHS Compliant: Yes; Tolerance: 25%; Number of Circuits: 1
R14 = CMP-2002-07697-1: Part Number: RC0402FR-07470RL; Manufacturer: Yageo / Phycomp
R16 = CMP-00178-1: Res General Purpose Thick Film 0402 4.7K Ohm 1% 1/16W ±100ppm/°C Molded SMD Paper T/R; Power Rating: 63mW; Voltage Rating (AC): 50V; Power Dissipation: 62.5mW; REACH SVHC: Yes; Harmonized Tariff Schedule (HTS) Code: 8533.21.00.30; Composition: Thick Film; Max Operating Temperature: 155°C; Number of Terminals: 2; Min Operating Temperature: -55°C; Depth: 500µm; Introduction Date: 2008-07-18; Case Code (Metric): 1005; Pins: 2; Packaging: Tape & Reel; Height: 350µm; China RoHS: Non-Compliant; Lead Free: Lead Free; Termination: SMD/SMT; Tolerance: 1%; Schedule B: 8533210045, 8533210045; Length: 1mm; Lifecycle Status: Production; Case Code (Imperial): 0402; RoHS: Compliant; Width: 500µm; Mounting Technology: Surface Mount; Temperature Coefficient: 100ppm/°C; Export Control Classification Number (ECCN) Code: EAR99; Country of Origin: Mainland China, Taiwan; Working Voltage: 50V; Voltage Rating: 50V; Case/Package: 0402; Voltage Rating (DC): 50V; Military Standard: Not
U2 = CMP-04861-000013-1: IC DAC 16/24/32BIT 384K 20TSSOP; Power Consumption: 59.4mW; Number of Analog Inputs: 0; Supply Type: Analog; Resolution: 32b; Number of Analog Outputs: 2; Max Power Dissipation: 187mW; Sampling Rate: 384KS/s; Operating Supply Voltage: 3.3V; Number of Bits: 32; Max Supply Voltage: 3.6V; Interface: Serial; Polarity: Unipolar; Min Supply Voltage: 3V; Output Type: Voltage; Signal to Noise Ratio (SNR): 112dB; Contact Plating: Gold; Package Quantity: 2000; Number of Pins: 20; Max Operating Temperature: 85°C; Series: DirectPath™; Case/Package: TSSOP; Conversion Rate: 384KS/s; Number of DAC Channels: 2; Mount: Surface Mount; REACH SVHC: No SVHC; Packaging: Tape and Reel; Number of Converters: 2; Min Operating Temperature: -25°C; Lead Free: Lead Free

## Nets that join several sheets
3V3_DAC: RF_PDU (C33.1 R30.2 U4.1), DAC (6 pins)
3V3_PLL: RF_PDU (C37.1 R32.2 U6.1), RF_Gen (10 pins)
3V3_RF: RF_PDU (C35.1 R31.2 U5.1), RF_Gen (6 pins)
5V: ConnectorInterface (J5.1 J5.6 J5.11 J5.14), RF_PDU (9 pins), RF_Bypass (D1.1 K1.11)
CP_PWR: RF_PDU (6 pins), RF_Gen (6 pins)
GND: ConnectorInterface (28 pins), RF_PDU (22 pins), RF_Bypass (J4.2 Q2.2 R17.1 R18.1), RF_Gen (27 pins), DAC (17 pins)
LCK_DCT: RF_Bypass (Q1.1 R17.2), RF_Gen (R3.2)
OUT+: RF_Bypass (L2.1), RF_Gen (C1.2)
OUT-: RF_Bypass (L2.2), RF_Gen (C4.2)
RF_PWR_EN: RF_PDU (U3.4 U5.3 U6.3), RF_Bypass (Q2.1 R18.2)
TUNE: RF_Gen (C5.1 IC1.3 R11.2 R12.2), DAC (DNP2.2 R15.2)